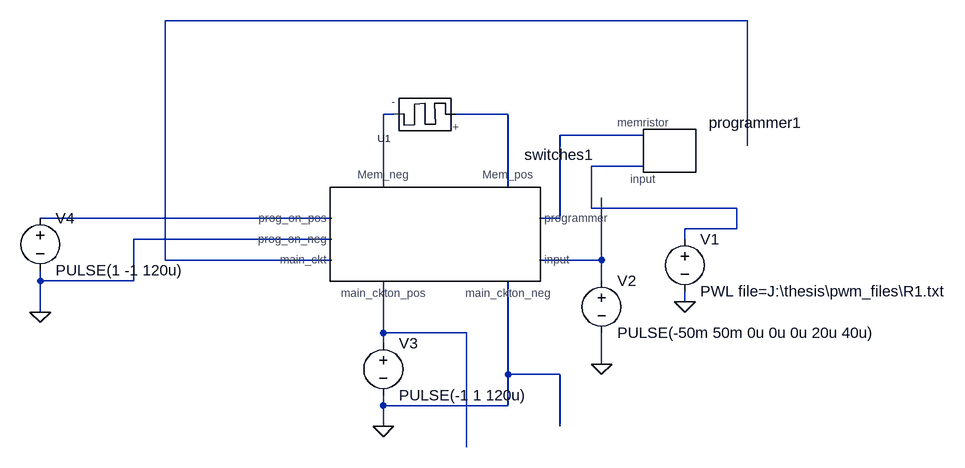
[diagram p0: schematic Draft3.asc]
Draft3.asc, the LTspice schematic file:
Version 4
SHEET 1 880 3220
WIRE -160 2544 -1056 2544
WIRE -704 2688 -720 2688
WIRE -528 2688 -608 2688
WIRE -320 2720 -448 2720
WIRE -160 2736 -160 2544
WIRE -320 2768 -400 2768
WIRE -720 2800 -720 2688
WIRE -528 2800 -528 2688
WIRE -400 2832 -400 2768
WIRE -176 2832 -400 2832
WIRE -800 2848 -1248 2848
WIRE -448 2848 -448 2720
WIRE -448 2848 -480 2848
WIRE -176 2864 -176 2832
WIRE -176 2864 -256 2864
WIRE -800 2880 -1104 2880
WIRE -256 2880 -256 2864
WIRE -1056 2912 -1056 2544
WIRE -800 2912 -1056 2912
WIRE -384 2912 -384 2816
WIRE -384 2912 -480 2912
WIRE -1248 2944 -1248 2928
WIRE -1104 2944 -1104 2880
WIRE -1104 2944 -1248 2944
WIRE -384 2944 -384 2912
WIRE -256 2976 -256 2960
WIRE -1248 2992 -1248 2944
WIRE -720 3024 -720 2944
WIRE -592 3024 -720 3024
WIRE -720 3040 -720 3024
WIRE -384 3072 -384 3024
WIRE -528 3088 -528 2944
WIRE -448 3088 -528 3088
WIRE -720 3136 -720 3120
WIRE -528 3136 -528 3088
WIRE -528 3136 -720 3136
WIRE -720 3168 -720 3136
WIRE -448 3168 -448 3088
WIRE -592 3200 -592 3024
FLAG -256 2976 0
FLAG -384 3072 0
FLAG -720 3168 0
FLAG -1248 2992 0
SYMBOL memristormodel -688 2688 R180
SYMATTR InstName U1
SYMATTR Value MEM_YAKOPCIC
SYMBOL voltage -256 2864 R0
WINDOW 123 0 0 Left 2
WINDOW 39 0 0 Left 2
SYMATTR InstName V1
SYMATTR Value PWL file=J:\thesis\pwm_files\R1.txt
SYMBOL voltage -384 2928 R0
WINDOW 123 0 0 Left 2
WINDOW 39 0 0 Left 2
SYMATTR InstName V2
SYMATTR Value PULSE(-50m 50m 0u 0u 0u 20u 40u)
SYMBOL voltage -720 3024 R0
WINDOW 123 0 0 Left 2
WINDOW 39 0 0 Left 2
SYMATTR InstName V3
SYMATTR Value PULSE(-1 1 120u)
SYMBOL voltage -1248 2832 R0
WINDOW 123 0 0 Left 2
WINDOW 39 0 0 Left 2
SYMATTR InstName V4
SYMATTR Value PULSE(1 -1 120u)
SYMBOL programmer_block -272 2768 R0
SYMATTR InstName programmer1
SYMBOL switch_block -720 2848 R0
SYMATTR InstName switches1

The netlist it stands for:
* Draft3.asc
XU1 N003 N002 M MEM_YAKOPCIC  ; pins + -
V1 N005 0 PWL file=J:\thesis\pwm_files\R1.txt
V2 N007 0 PULSE(-50m 50m 0u 0u 0u 20u 40u)
V3 N008 0 PULSE(-1 1 120u)
V4 N006 0 PULSE(1 -1 120u)
Xprogrammer1 N004 N005 programmer_block  ; pins memristor input
Xswitches1 N002 N003 N006 0 N001 N008 0 N004 N007 switch_block  ; pins Mem_neg Mem_pos prog_on_pos prog_on_neg main_ckt main_ckton_pos main_ckton_neg programmer input
.backanno
.end